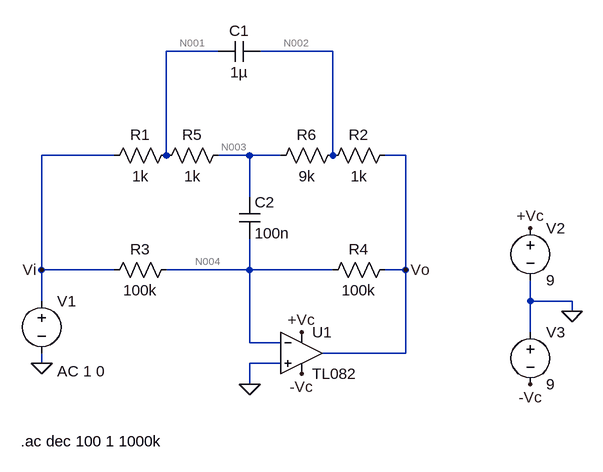
[diagram p0: schematic Ecualizador de frecuencias bajas.asc]
* Ecualizador de frecuencias bajas.asc
R1 N001 Vi 1k
R2 Vo N002 1k
R3 N004 Vi 100k
R4 Vo N004 100k
C2 N003 N004 100n
C1 N002 N001 1µ
* U1: TL082 (symbol PAULOlib\TL082 not available, pins judged from their places): In+=0 In-=N004 V+=+Vc V-=-Vc OUT=Vo
V1 Vi 0 AC 1 0
V2 +Vc 0 9
V3 0 -Vc 9
R5 N003 N001 1k
R6 N002 N003 9k
.ac dec 100 1 1000k
.backanno
.end

* Results of the author's LTspice run, read from the files saved beside the schematic
* Operating Point, zero values left out:
*   V(n001) = 2.154 µV
*   V(vo) = 25.85 µV
*   V(n002) = 23.69 µV
*   V(n004) = 10.97 µV
*   V(n003) = 4.308 µV
*   V(-vc) = -9 V
*   V(+vc) = 9 V
*   I(R6) = 2.154 nA
*   I(R5) = 2.154 nA
*   I(R4) = 148.8 pA
*   I(R3) = 109.7 pA
*   I(R2) = 2.154 nA
*   I(R1) = 2.154 nA
*   I(V3) = -8.595 mA
*   I(V2) = -8.594 mA
*   I(V1) = 2.264 nA
*   Ix(u1:1) = 39.05 pA
*   Ix(u1:2) = 39.05 pA
*   Ix(u1:3) = 8.594 mA
*   Ix(u1:4) = -8.595 mA
*   Ix(u1:5) = -2.303 nA
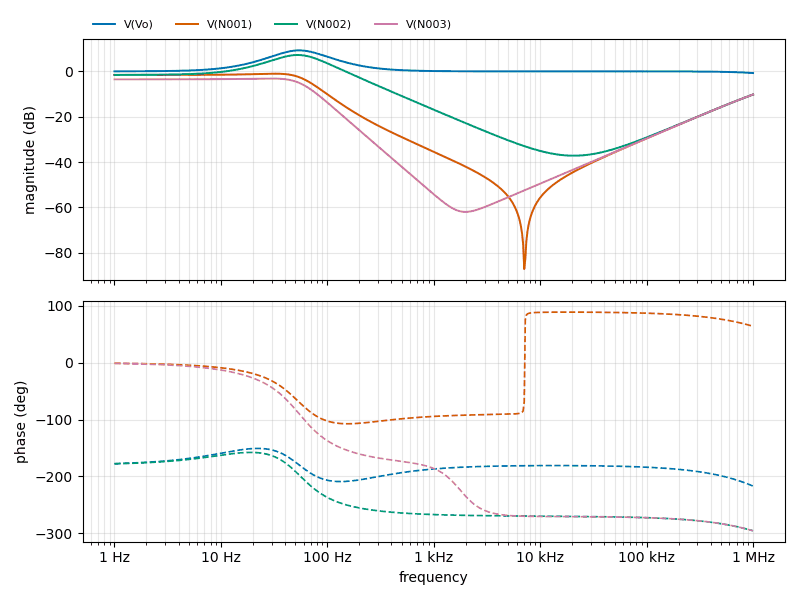
[diagram p1: AC Analysis of Ecualizador de frecuencias bajas.asc, plotted from the saved traces]
* AC Analysis, 1 run:
*   V(Vo): 0.02 dB at 1 Hz, -0.74 dB at 1 MHz, peak 9.26 dB at 54.95 Hz, 3 dB below the peak at 28.67 Hz and 103.1 Hz
*   V(N001): -1.58 dB at 1 Hz, -10.23 dB at 1 MHz, peak -1.03 dB at 32.36 Hz, 3 dB below the peak at 63.68 Hz
*   V(N002): -1.57 dB at 1 Hz, -10.23 dB at 1 MHz, peak 7.23 dB at 52.48 Hz, 3 dB below the peak at 27.39 Hz and 92.66 Hz
*   V(N003): -3.52 dB at 1 Hz, -10.23 dB at 1 MHz, peak -3.15 dB at 28.84 Hz, 3 dB below the peak at 60.63 Hz